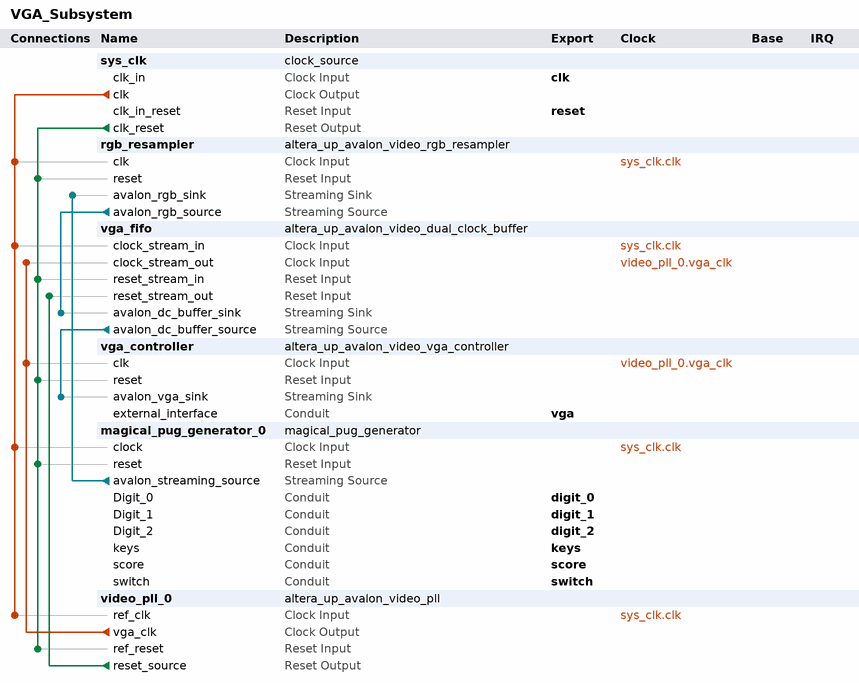
[diagram p0: system contents]
# Platform Designer (Qsys) system VGA_Subsystem, Cyclone V 5CSEMA5F31C6
# Parameters at their usual value, and those the tool derives, are not listed.
package require -exact qsys 18.0
create_system VGA_Subsystem
set_project_property DEVICE_FAMILY {Cyclone V}
set_project_property DEVICE 5CSEMA5F31C6

add_instance sys_clk clock_source 18.1
set_instance_parameter_value sys_clk clockFrequency 50000000

add_instance rgb_resampler altera_up_avalon_video_rgb_resampler 18.0
set_instance_parameter_value rgb_resampler alpha 1023
set_instance_parameter_value rgb_resampler input_type {24-bit RGB}
set_instance_parameter_value rgb_resampler output_type {30-bit RGB}

add_instance vga_fifo altera_up_avalon_video_dual_clock_buffer 18.0
set_instance_parameter_value vga_fifo color_bits 10

add_instance vga_controller altera_up_avalon_video_vga_controller 18.1
set_instance_parameter_value vga_controller board DE1-SoC
set_instance_parameter_value vga_controller resolution {VGA 640x480}

add_instance magical_pug_generator_0 magical_pug_generator 1.0
set_instance_parameter_value magical_pug_generator_0 DW 23
set_instance_parameter_value magical_pug_generator_0 HEIGHT 480
set_instance_parameter_value magical_pug_generator_0 HW 9
set_instance_parameter_value magical_pug_generator_0 WIDTH 640
set_instance_parameter_value magical_pug_generator_0 WW 10

add_instance video_pll_0 altera_up_avalon_video_pll 18.0
set_instance_parameter_value video_pll_0 camera {5MP Digital Camera (THDB_D5M)}
set_instance_parameter_value video_pll_0 gui_refclk 50.0
set_instance_parameter_value video_pll_0 lcd {7" LCD on VEEK-MT and MTL/MTL2 Modules}

# connections
add_connection sys_clk.clk magical_pug_generator_0.clock clock
add_connection sys_clk.clk rgb_resampler.clk clock
add_connection sys_clk.clk vga_fifo.clock_stream_in clock
add_connection sys_clk.clk video_pll_0.ref_clk clock
add_connection video_pll_0.vga_clk vga_controller.clk clock
add_connection video_pll_0.vga_clk vga_fifo.clock_stream_out clock
add_connection sys_clk.clk_reset magical_pug_generator_0.reset reset
add_connection sys_clk.clk_reset rgb_resampler.reset reset
add_connection sys_clk.clk_reset vga_controller.reset reset
add_connection sys_clk.clk_reset vga_fifo.reset_stream_in reset
add_connection sys_clk.clk_reset video_pll_0.ref_reset reset
add_connection video_pll_0.reset_source vga_fifo.reset_stream_out reset
add_connection magical_pug_generator_0.avalon_streaming_source rgb_resampler.avalon_rgb_sink avalon_streaming
add_connection rgb_resampler.avalon_rgb_source vga_fifo.avalon_dc_buffer_sink avalon_streaming
add_connection vga_fifo.avalon_dc_buffer_source vga_controller.avalon_vga_sink avalon_streaming

# exported interfaces
add_interface clk clock sink
set_interface_property clk EXPORT_OF sys_clk.clk_in
add_interface digit_0 conduit end
set_interface_property digit_0 EXPORT_OF magical_pug_generator_0.Digit_0
add_interface digit_1 conduit end
set_interface_property digit_1 EXPORT_OF magical_pug_generator_0.Digit_1
add_interface digit_2 conduit end
set_interface_property digit_2 EXPORT_OF magical_pug_generator_0.Digit_2
add_interface keys conduit end
set_interface_property keys EXPORT_OF magical_pug_generator_0.keys
add_interface reset reset sink
set_interface_property reset EXPORT_OF sys_clk.clk_in_reset
add_interface score conduit end
set_interface_property score EXPORT_OF magical_pug_generator_0.score
add_interface switch conduit end
set_interface_property switch EXPORT_OF magical_pug_generator_0.switch
add_interface vga conduit end
set_interface_property vga EXPORT_OF vga_controller.external_interface

set_interconnect_requirement {$system} qsys_mm.clockCrossingAdapter HANDSHAKE
set_interconnect_requirement {$system} qsys_mm.enableEccProtection FALSE
set_interconnect_requirement {$system} qsys_mm.insertDefaultSlave FALSE
set_interconnect_requirement {$system} qsys_mm.maxAdditionalLatency 1

save_system VGA_Subsystem.qsys
